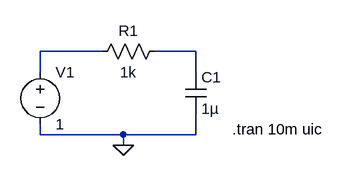
[diagram p0: schematic 01_RCCircuit.asc]
01_RCCircuit.asc, the LTspice schematic file:
Version 4
SHEET 1 880 680
WIRE 320 192 224 192
WIRE 464 192 400 192
WIRE 224 224 224 192
WIRE 464 224 464 192
WIRE 224 320 224 304
WIRE 352 320 224 320
WIRE 464 320 464 288
WIRE 464 320 352 320
WIRE 352 336 352 320
FLAG 352 336 0
SYMBOL voltage 224 208 R0
SYMATTR InstName V1
SYMATTR Value 1
SYMBOL res 416 176 R90
WINDOW 0 0 56 VBottom 2
WINDOW 3 32 56 VTop 2
SYMATTR InstName R1
SYMATTR Value 1k
SYMBOL cap 448 224 R0
SYMATTR InstName C1
SYMATTR Value 1µ
TEXT 520 312 Left 2 !.tran 10m uic

The netlist it stands for:
* 01_RCCircuit.asc
V1 N001 0 1
R1 N002 N001 1k
C1 N002 0 1µ
.tran 10m uic
.backanno
.end